# Altium schematic sheet REUN.468349.001_PSU_Board_Power.SchDoc
size 420 x 297 mm; DocumentNumber: РЕУН.468349.001 Э3 2D; SheetNumber: 2; Format: A3
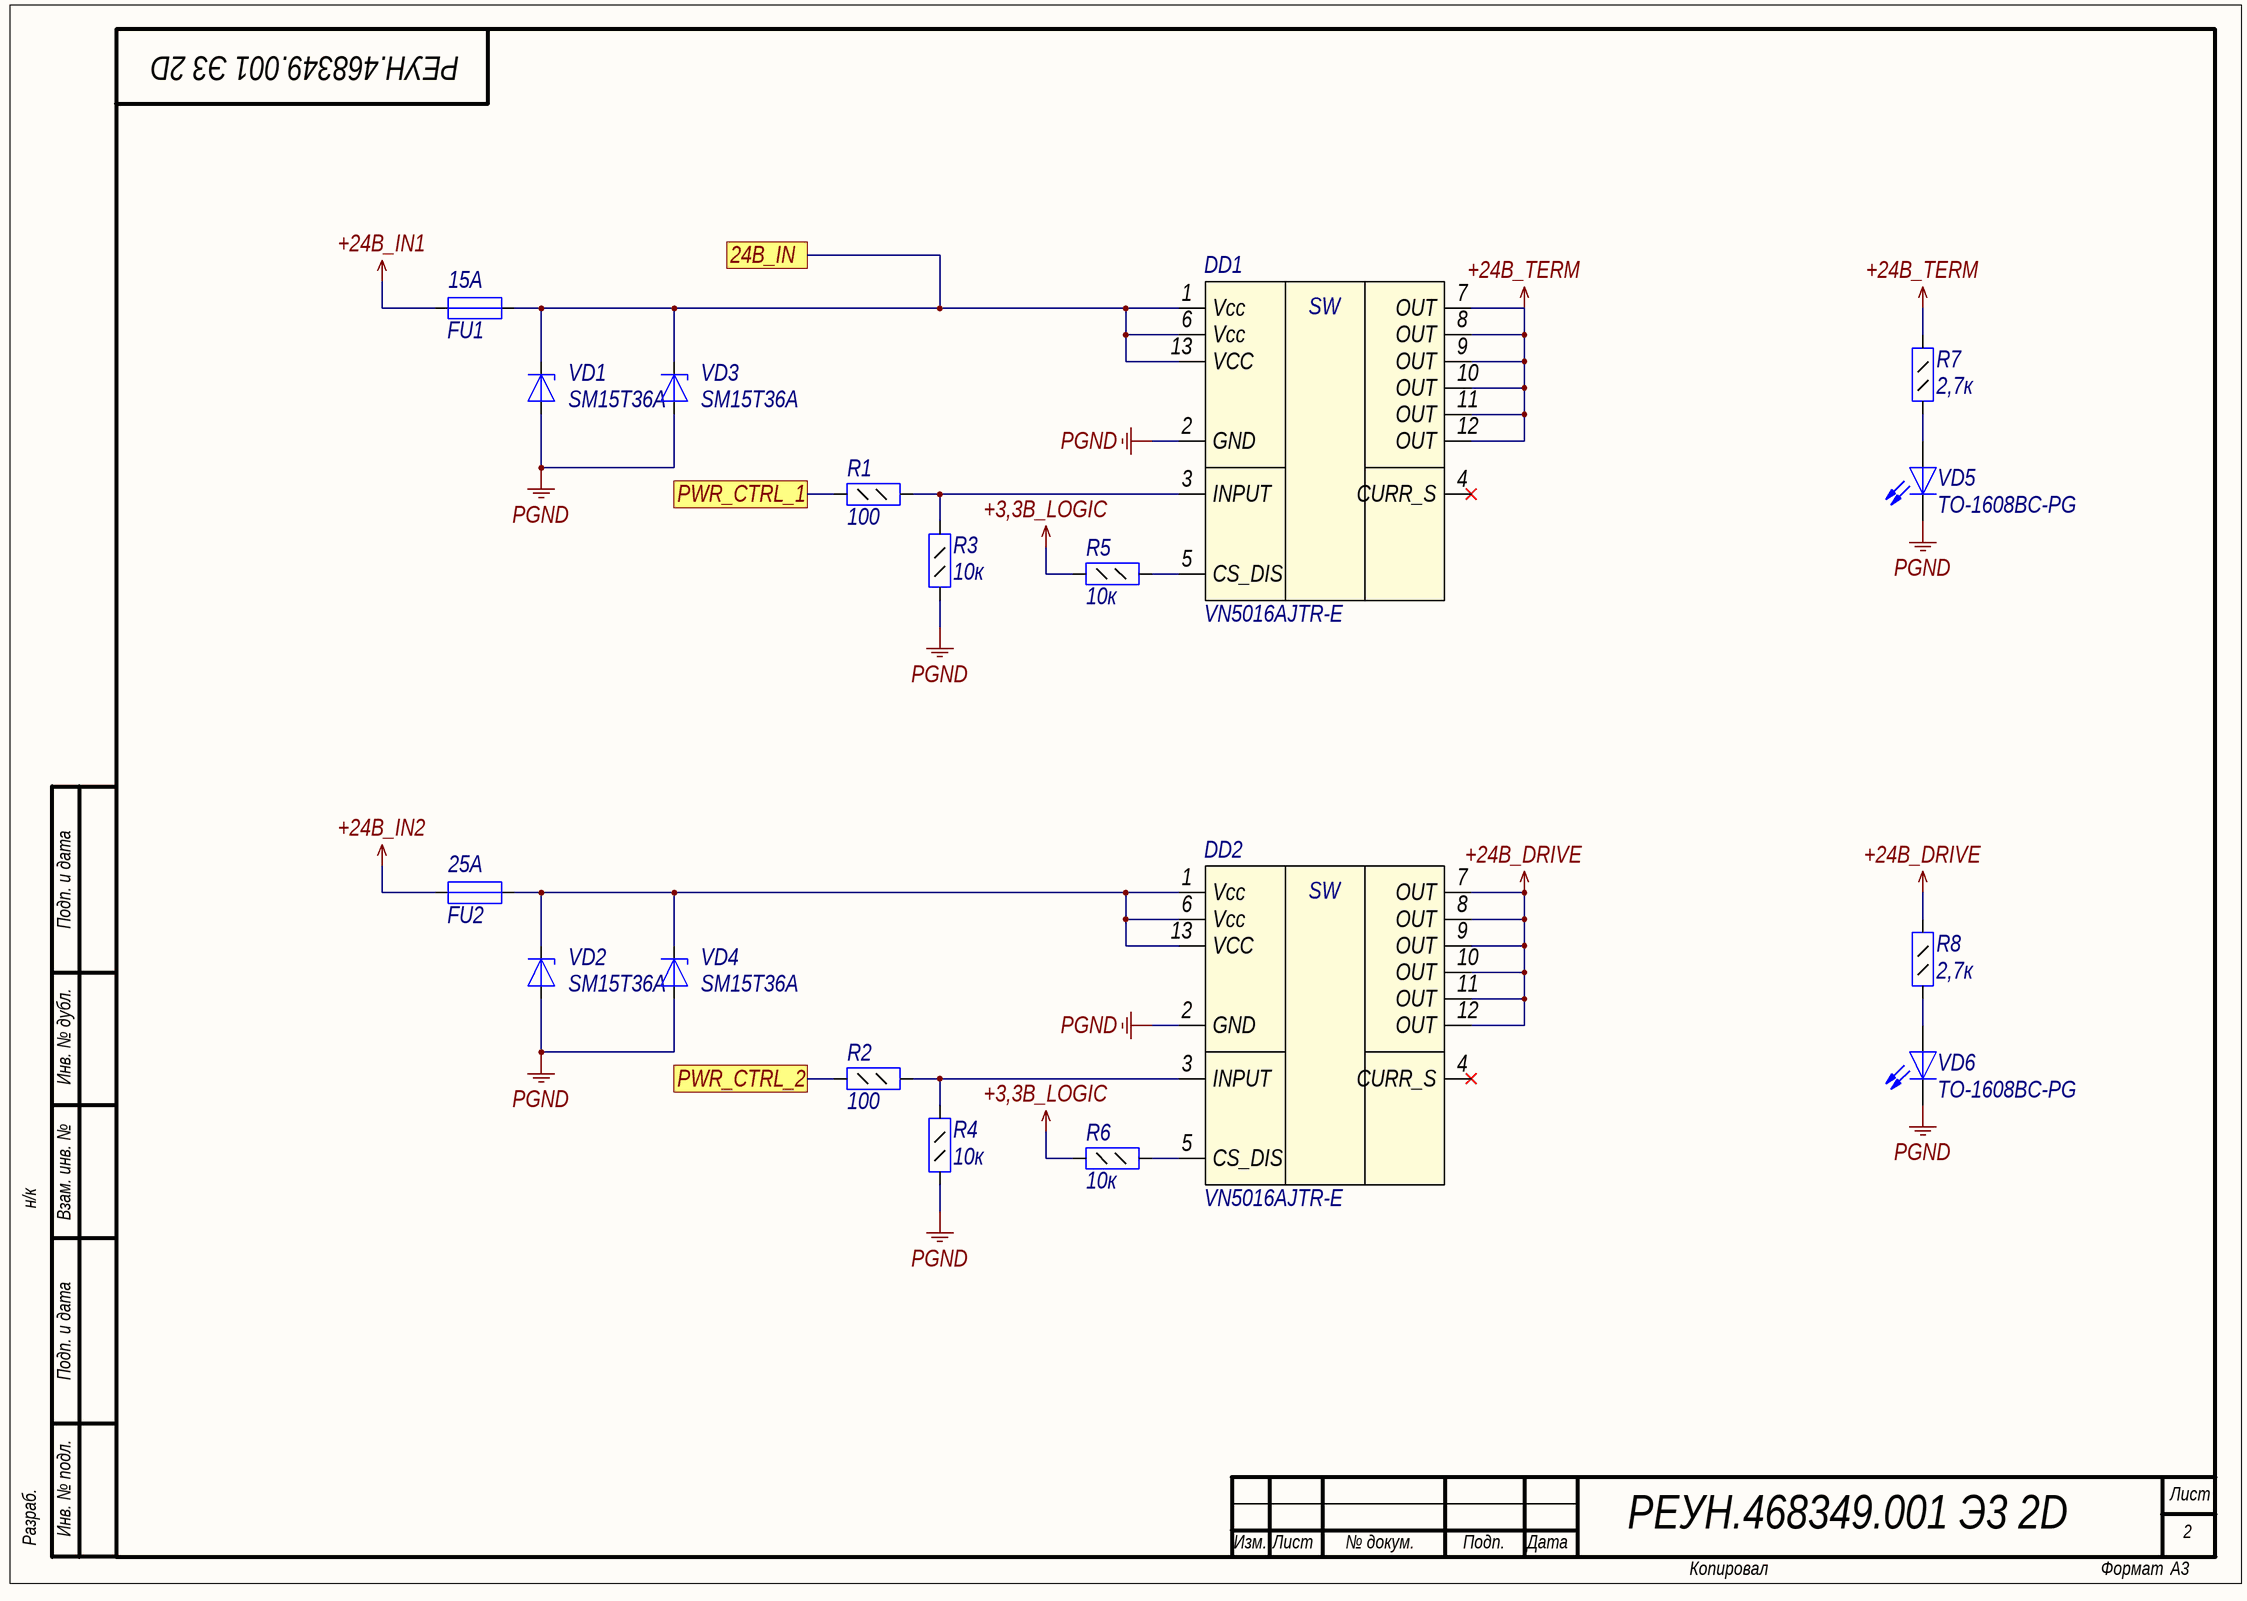
[diagram p0: REUN.468349.001_PSU_Board_Power.SchDoc]

## Parts
DD1  VN5016AJTR-E  [POWERSO12]
DD2  VN5016AJTR-E  [POWERSO12]
FU1  I max: 15А  [F6.3x32]  (hidden comment: Fuse)
FU2  I max: 25A  [F6.3x30]  (hidden comment: Fuse)
R1  value 100  [R0805]  (hidden comment: Resistor_0,125Вт)
R2  value 100  [R0805]  (hidden comment: Resistor_0,125Вт)
R3  value 10к  [R0805]  (hidden comment: Resistor_0,125Вт)
R4  value 10к  [R0805]  (hidden comment: Resistor_0,125Вт)
R5  value 10к  [R0805]  (hidden comment: Resistor_0,125Вт)
R6  value 10к  [R0805]  (hidden comment: Resistor_0,125Вт)
R7  value 2,7к  [R0805]  (hidden comment: Resistor_0,125Вт)
R8  value 2,7к  [R0805]  (hidden comment: Resistor_0,125Вт)
VD1  SM15T36A  [SMC]
VD2  SM15T36A  [SMC]
VD3  SM15T36A  [SMC]
VD4  SM15T36A  [SMC]
VD5  TO-1608BC-PG  [L_0603_GREEN]
VD6  TO-1608BC-PG  [L_0603_GREEN]

## Ports
24B_IN, PWR_CTRL_1, PWR_CTRL_2

## Nets
+3,3B_LOGIC: R5.1 R6.1
+24B_DRIVE: DD2.7(OUT) DD2.8(OUT) DD2.9(OUT) DD2.10(OUT) DD2.11(OUT) DD2.12(OUT) R8.2
+24B_IN1: FU1.1
+24B_IN2: FU2.1
+24B_TERM: DD1.7(OUT) DD1.8(OUT) DD1.9(OUT) DD1.10(OUT) DD1.11(OUT) DD1.12(OUT) R7.2
PGND: DD1.2(GND) DD2.2(GND) R3.1 R4.1 VD1.2(A) VD2.2(A) VD3.2(A) VD4.2(A) VD5.1(K) VD6.1(K)
24B_IN: DD1.1(Vcc) DD1.6(Vcc) DD1.13(VCC) FU1.2 VD1.1(K) VD3.1(K) ; port 24B_IN
PWR_CTRL_1: R1.1 ; port PWR_CTRL_1
PWR_CTRL_2: R2.1 ; port PWR_CTRL_2
NetDD1_3: DD1.3(INPUT) R1.2 R3.2
NetDD1_5: DD1.5(CS_DIS) R5.2
NetDD2_1: DD2.1(Vcc) DD2.6(Vcc) DD2.13(VCC) FU2.2 VD2.1(K) VD4.1(K)
NetDD2_3: DD2.3(INPUT) R2.2 R4.2
NetDD2_5: DD2.5(CS_DIS) R6.2
NetR7_1: R7.1 VD5.2(A)
NetR8_1: R8.1 VD6.2(A)

Not connected (* = marked no-connect by the designer): DD1 4(CURR_S)*; DD2 4(CURR_S)*

## Notes on the sheet
- Подп. и дата
- Инв. № дубл.
- н/к
- Взам. инв. №
- Разраб.
- Инв. № подл.
- Лист
- Изм.
- № докум.
- Подп.
- Дата
- Копировал
- Формат
- (in symbol pwrsw5) SW

## Library data of the parts
DD1 DD2 = pwrsw5: Single channel high side driver with analog / current sense for automotive applications; Manufacturer: STMicroelectronics; Overvoltage protection: 36B; Output clamp: 52В; Operating voltage: 4,5-36B; On-state resistance: 0,016Ohm; Load current: 65A; Input Logic: 3B CMOS; Short circuit: 91А; Current sense ratio: 45000; id: pwrsw5; Part Name: Driver with analog current sense; Part Number: VN5016AJTR-E
FU1 = fuse26: Предохранитель; Part Name: Glass Miniature Fuse-Links; Manufacture: Siba; Part Number: 189000.15; id: fuse26; V max: 250В; Slow blow(min): 80ms 10*I
FU2 = fuse28: Предохранитель; Part Name: Fast Blow Fuse; Manufacture: KLS electronic co ltd; Part Number: KLS5-1046-25000; id: fuse28; V max: 250В
R1 R2 = res49: Резистор; Manufacture: Yageo; Part Number: RC0805FR-07100RL; id: res49; Accuracy: 0.01; Part Name: Resistor; Power: 0,125Вт
R3-R6 = res101: Резистор; Manufacture: Yageo; Part Number: RC0805FR-0710KL; id: res101; Accuracy: 0.01; Part Name: Resistor; Power: 0,125Вт
R7 R8 = res87: Резистор; Manufacture: Yageo; Part Number: RC0805FR-072K7; id: res87; Accuracy: 0.01; Part Name: Resistor; Power: 0,125Вт
VD1-VD4 = SM15T36A: Cтабилитрон (лавинный выпрямительный диод) односторонний; Part Name: TVS diode Unidirectional; Manufacture: ST Microelectronics; id: tvs258; Leakage Current: 0.2uA; Stand-off Voltage: 34.2B; Breakdown Voltage: 36B; Clamping voltage: 37.8B; Peak Pulse Power: 1500W; Number of diodes: 1; Part Number: SM15T36A
VD5 VD6 = diode43: Светодиод; Part Name: LED green 0603; Manufacture: OASISTEK; id: diode43; Part Number: TO-1608BC-PG